# EAGLE design WaterProbe_5 (EAGLE 9.1.3)
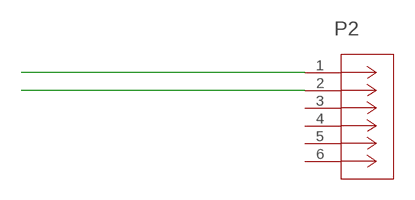
[diagram p0: schematic, sheet 1]

## Parts
P2  6PINJSTS6B-ZR(LF)(SN)  [S6B-ZR]

## Nets
N$1: P2.1
N$2: P2.2
Unconnected: P2.3 P2.4 P2.5 P2.6

## Library data of the parts
P2 = DROP 6pin JST:6PINJSTS6B-ZR(LF)(SN): 6 pin JST Connector Sourced from Digikey; MANUFACTURER_PART_NUMBER: S6BZRLFSN; VENDOR: JST

## Board
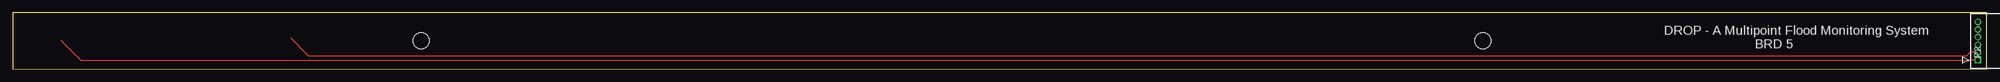
[diagram p1: board, top side]

Size 386.74 x 11.04 mm. Coordinates in mm from the lower left corner, seen from the top.
Outline: 0,0.04 386.74,0 386.74,11 0,11.04 0,0.04
Copper layers (1*16): Top 0.035mm / dielectric 1.5mm / Bottom 0.035mm
Design rules "default": minimum track width 6mil, minimum drill 0.35mm, track to track 6mil, track to pad 6mil, pad to pad 6mil, via to via 6mil, smd to smd 6mil, copper to edge 40mil, drill to drill 6mil, minimum pad ring 10mil, minimum via ring 8mil, stop-mask expansion 4mil, vias tented up to drill 0mil, thermal gap 10mil
Holes 3.2 mm at 80,5.54 288,5.54

### Footprints (pad centres in the part's own frame; a part is rotated, then mirrored left to right if it is on the bottom)
S6B-ZR = drill 0.762 pad 1.27 square: 1 -7.493,0 | drill 0.762 pad 1.27: 2 -5.994,0; 3 -4.496,0; 4 -2.997,0; 5 -1.499,0; 6 0,0

### Placement (x,y rotation side)
P2  385.01,9.26 90 top

### Tracks (layer width: path | path; a pad name or v marks a point on that pad's centre or on a via)
N$1
  Top 0.152: P2.1 383.48,1.77 383.3,1.59 13.45,1.59 9.5,5.54
N$2
  Top 0.152: P2.2 383.48,3.27 382.75,2.54 58,2.54 54.5,6.04

### Text on the board
tNames: DROP - A Multipoint Flood Monitoring System / BRD 5